# EAGLE design TB6560_stp (EAGLE 4.16)
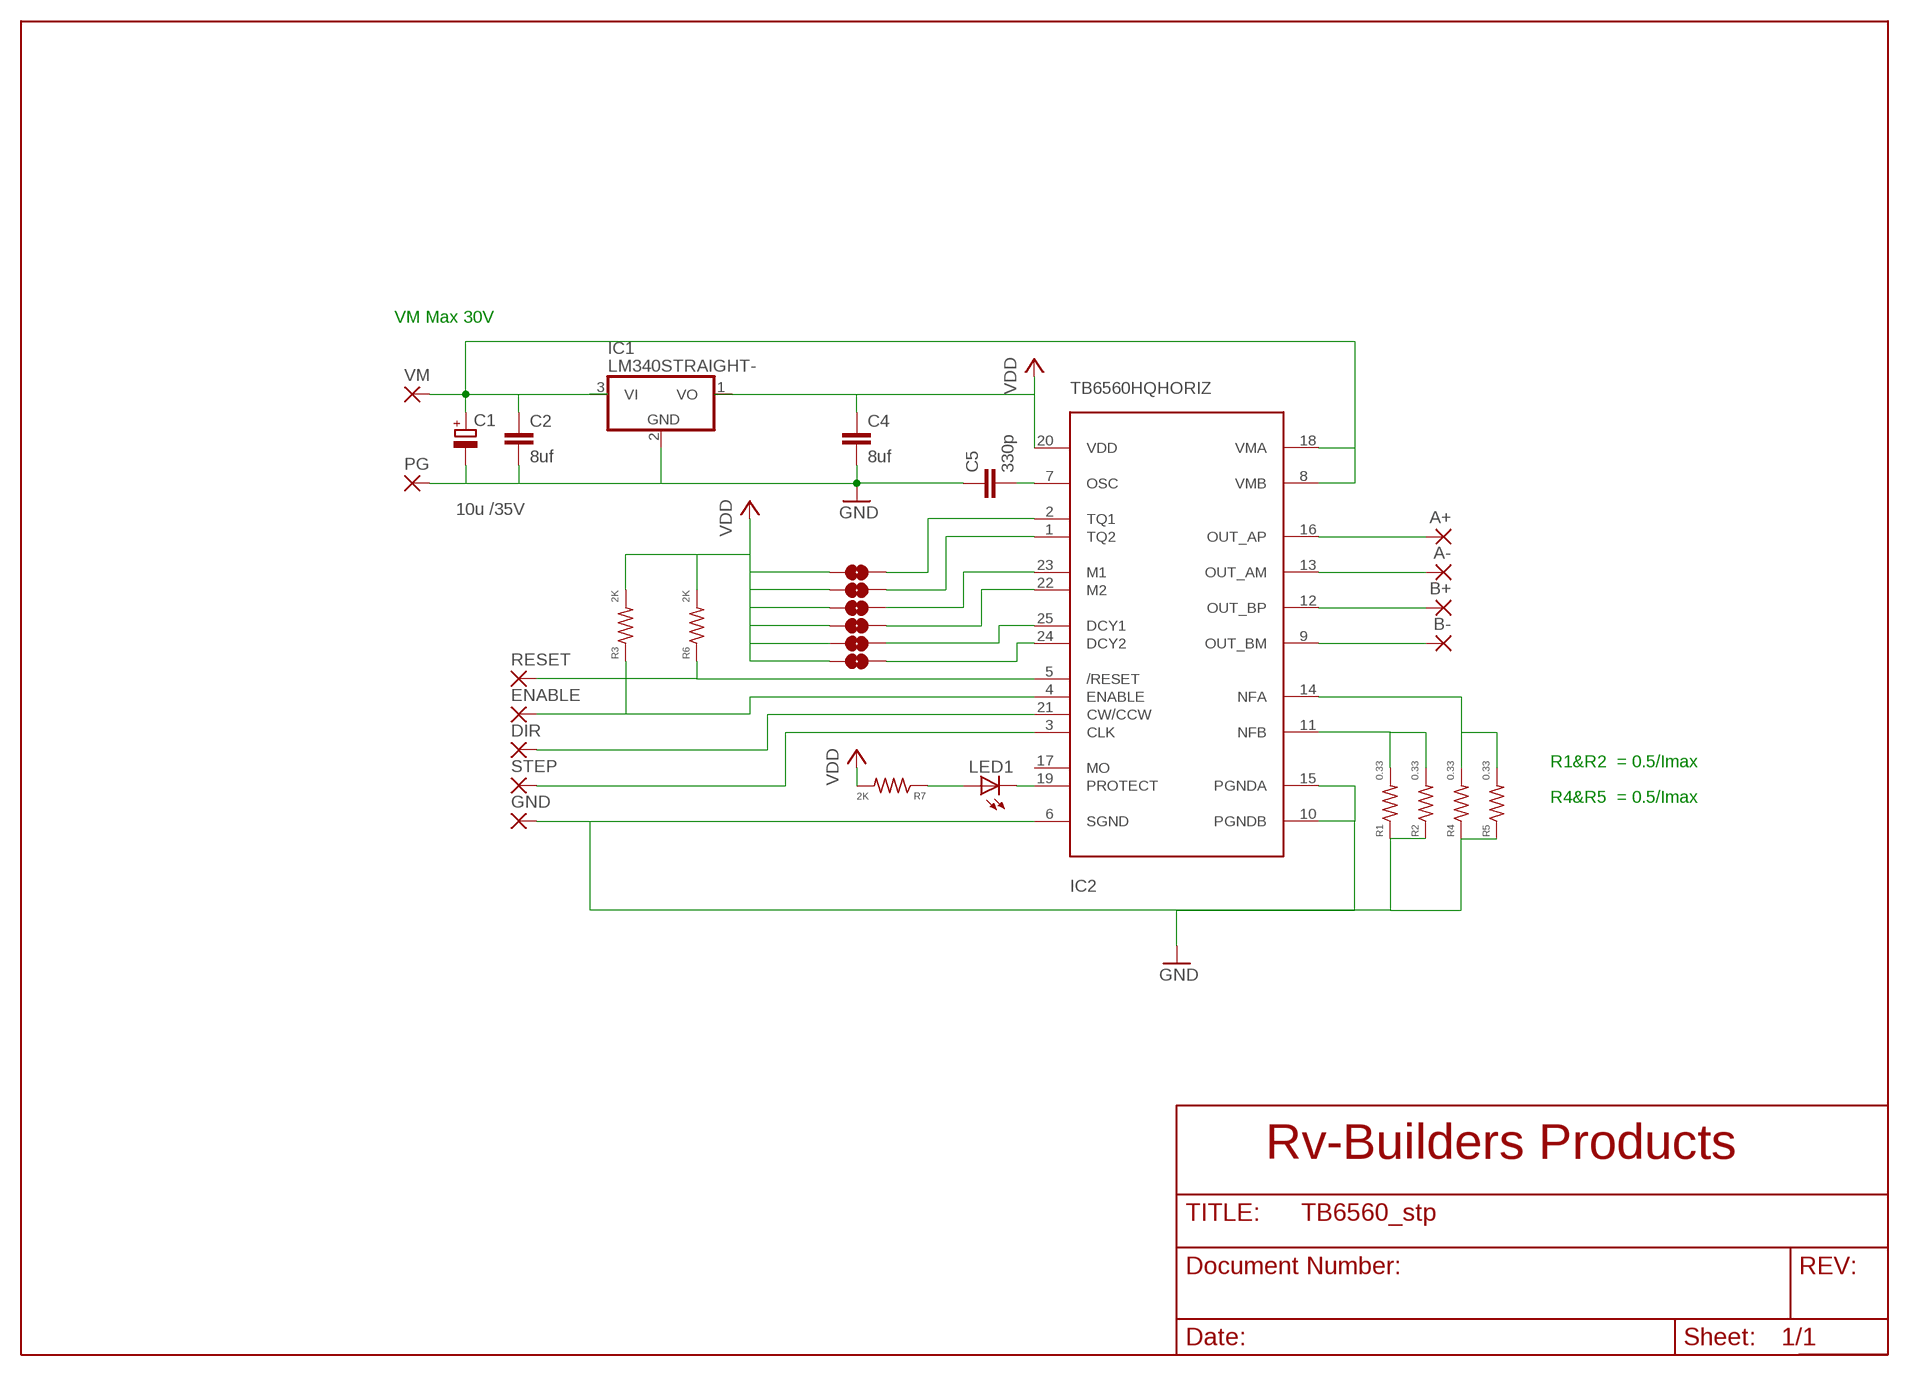
[diagram p0: schematic, sheet 1]

## Parts
A+  1,6/0,9  [1,6/0,9]
A-  1,6/0,9  [1,6/0,9]
B+  1,6/0,9  [1,6/0,9]
B-  1,6/0,9  [1,6/0,9]
C1  10u /35V  CPOL-EUSMCD  [SMC_D]
C2  8uf  C-EUC1210  [C1210]
C4  8uf  C-EUC1210  [C1210]
C5  330p  C-EUC0805  [C0805]
DIR  1,6/0,9  [1,6/0,9]
ENABLE  1,6/0,9  [1,6/0,9]
GND  1,6/0,9  [1,6/0,9]
IC1  LM340STRAIGHT-  [TO92-]
IC2  TB6560HQHORIZ  [HZIP-25]
LED1  LEDCHIP-LED0603  [CHIP-LED0603]
PG  1,6/0,9  [1,6/0,9]
R1  0.33  R-US_R2010  [R2010]
R2  0.33  R-US_R2010  [R2010]
R3  2K  R-US_R0603  [R0603]
R4  0.33  R-US_R2010  [R2010]
R5  0.33  R-US_R2010  [R2010]
R6  2K  R-US_R0603  [R0603]
R7  2K  R-US_R0603  [R0603]
RESET  1,6/0,9  [1,6/0,9]
STEP  1,6/0,9  [1,6/0,9]
U$3  SOLDERBRIDGE  [SOLDER_BRIDGE]
U$5  SOLDERBRIDGE  [SOLDER_BRIDGE]
U$6  SOLDERBRIDGE  [SOLDER_BRIDGE]
U$7  SOLDERBRIDGE  [SOLDER_BRIDGE]
U$8  SOLDERBRIDGE  [SOLDER_BRIDGE]
U$9  SOLDERBRIDGE  [SOLDER_BRIDGE]
VM  1,6/0,9  [1,6/0,9]

## Nets
+5V: C4.1 IC1.1(VO) IC2.20(VDD) R3.2 R6.2 R7.2 U$3.P$1 U$5.P$1 U$6.P$1 U$7.P$1 U$8.P$1 U$9.P$1 ; supply symbol labelled VDD
/A: A-.1(P) IC2.13(OUT_AM)
/B: B-.1(P) IC2.9(OUT_BM)
A: A+.1(P) IC2.16(OUT_AP)
B: B+.1(P) IC2.12(OUT_BP)
DCY1: IC2.25(DCY1) U$8.P$2
DCY2: IC2.24(DCY2) U$9.P$2
DIR: DIR.1(P) IC2.21(CW/CCW)
ENA: ENABLE.1(P) IC2.4(ENABLE) R3.1
GND: C1.- C2.2 C4.2 C5.1 GND.1(P) IC1.2(GND) IC2.6(SGND) IC2.10(PGNDB) IC2.15(PGNDA) PG.1(P) R1.1 R2.1 R4.1 R5.1
M1: IC2.23(M1) U$6.P$2
M2: IC2.22(M2) U$7.P$2
N$1: LED1.A R7.1
N$2: IC2.19(PROTECT) LED1.C
N$4: IC2.5(/RESET) R6.1 RESET.1(P)
NFA: IC2.14(NFA) R4.2 R5.2
NFB: IC2.11(NFB) R1.2 R2.2
OSC: C5.2 IC2.7(OSC)
STEP: IC2.3(CLK) STEP.1(P)
TQ1: IC2.2(TQ1) U$5.P$2
TQ2: IC2.1(TQ2) U$3.P$2
VM: C1.+ C2.1 IC1.3(VI) IC2.8(VMB) IC2.18(VMA) VM.1(P)
Unconnected: IC2.17(MO)

## Notes on the sheet
- VM Max 30V
- R1&R2  = 0.5/Imax
- R4&R5  = 0.5/Imax

## Library data of the parts
A+ A- B+ B- DIR ENABLE GND PG RESET STEP VM = wirepad:1,6/0,9: THROUGH-HOLE PAD
C1 = rcl:CPOL-EU: POLARIZED CAPACITOR, European symbol
C2 C4 C5 = rcl:C-EU: CAPACITOR, European symbol
IC1 = Stofer:LM340?-*: Positive VOLTAGE REGULATOR Source: http://cache.national.com/ds/LM/LM340.pdf
IC2 = Stofer:TB6560HQ
LED1 = led:LED: LED OSRAM: - CHIPLED LG R971, LG N971, LY N971, LG Q971, LY Q971, LO R971, LY R971 LH N974, LH R974 LS Q976, LO Q976, LY Q976 LO Q996 - Hyper CHIPLED LW Q18S LB Q993, LB Q99A, LB R99A - SideLED LS A670, LO A670, LY A670, LG A670, LP A670 LB A673, LV A673, LT A673, LW A673 LH A674 LY A675 LS A676, LA A676, LO A676, LY A676, LW A676 LS A679, LY A679, LG A679 - Hyper Micro SIDELED® LS Y876, LA Y876, LO Y876, LY Y876 LT Y87S - SmartLED LW L88C, LW L88S LB L89C, LB L89S, LG L890 LS L89K, LO L89K, LY L89K LS L896, LA L896, LO L896, LY L896 - TOPLED LS T670, LO T670, LY T670, LG T670, LP T670 LSG T670, LSP T670, LSY T670, LOP T670, LYG T670 LG T671, LOG T671, LSG T671 LB T673, LV T673, LT T673, LW T673 LH T674 LS T676, LA T676, LO T676, LY T676, LB T676, LH T676, LSB T676, LW T676 LB T67C, LV T67C, LT T67C, LS T67K, LO T67K, LY T67K, LW E67C LS E67B, LA E67B, LO E67B, LY E67B, LB E67C, LV E67C, LT E67C LW T67C LS T679, LY T679, LG T679 LS T770, LO T770, LY T770, LG T770, LP T770 LB T773, LV T773, LT T773, LW T773 LH T774 LS E675, LA E675, LY E675, LS T675 LS T776, LA T776, LO T776, LY T776, LB T776 LHGB T686 LT T68C, LB T68C - Hyper Mini TOPLED® LB M676 - Mini TOPLED Santana® LG M470 LS M47K, LO M47K, LY M47K Source: http://www.osram.convergy.de - LUMILED® LXK2-PW12-R00, LXK2-PW12-S00, LXK2-PW14-U00, LXK2-PW14-V00 LXK2-PM12-R00, LXK2-PM12-S00, LXK2-PM14-U00 LXK2-PE12-Q00, LXK2-PE12-R00, LXK2-PE12-S00, LXK2-PE14-T00, LXK2-PE14-U00 LXK2-PB12-K00, LXK2-PB12-L00, LXK2-PB12-M00, LXK2-PB14-N00, LXK2-PB14-P00, LXK2-PB14-Q00 LXK2-PR12-L00, LXK2-PR12-M00, LXK2-PR14-Q00, LXK2-PR14-R00 LXK2-PD12-Q00, LXK2-PD12-R00, LXK2-PD12-S00 LXK2-PH12-R00, LXK2-PH12-S00 LXK2-PL12-P00, LXK2-PL12-Q00, LXK2-PL12-R00 Source: www.luxeon.com
R1-R7 = rcl:R-US_: RESISTOR, American symbol
U$3 U$5-U$9 = Stofer:SOLDERBRIDGE

## Board
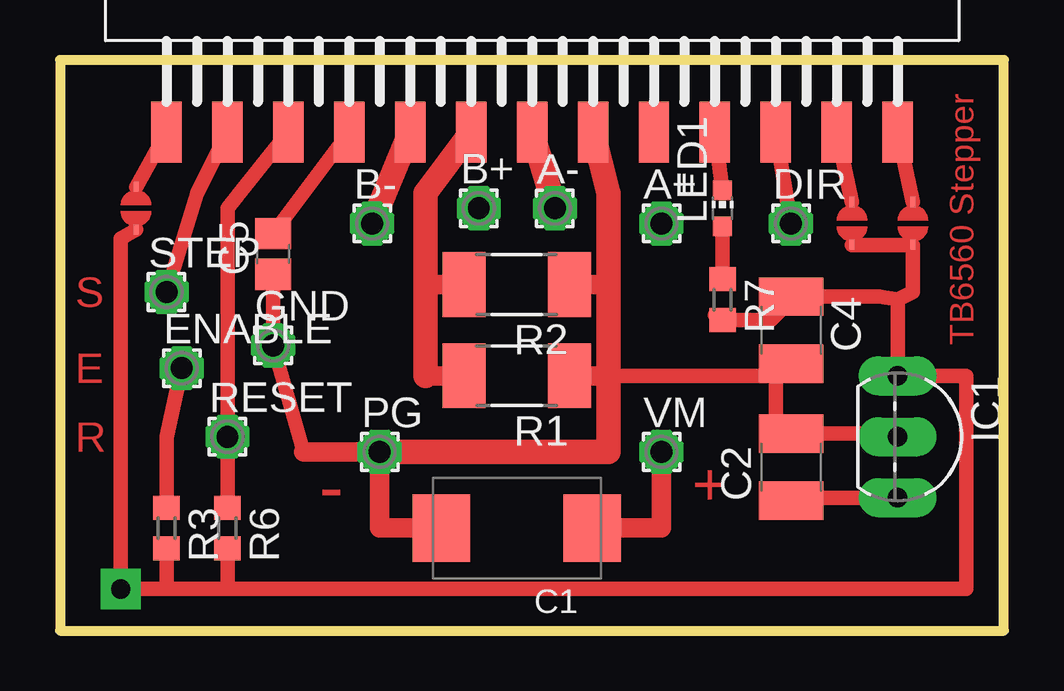
[diagram p1: board, top side]
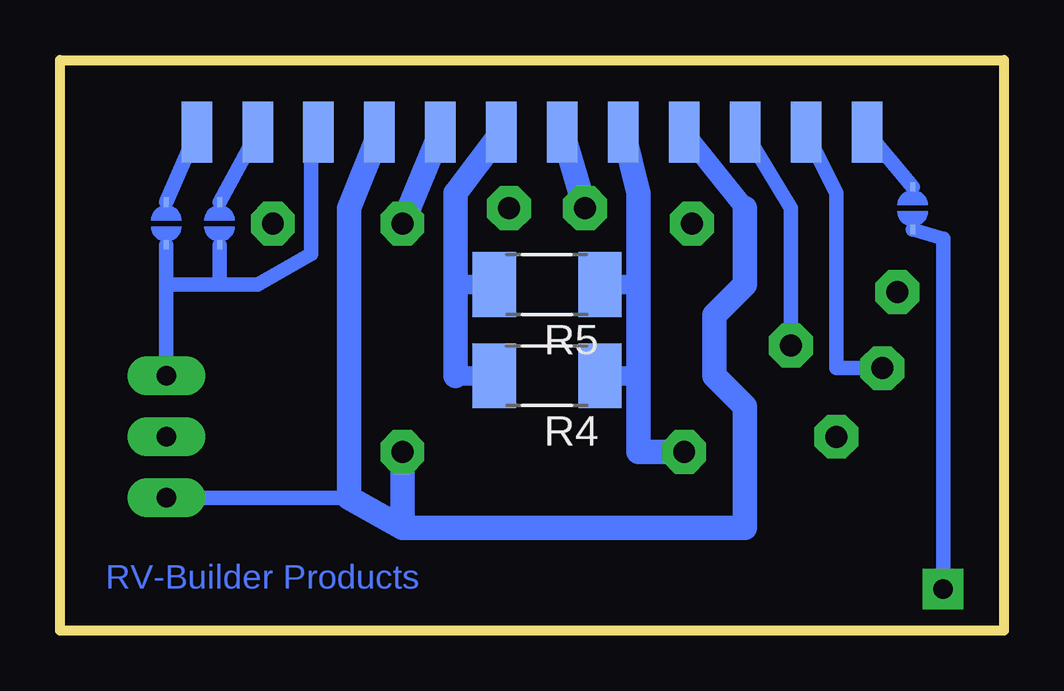
[diagram p2: board, bottom side, seen from below]

Size 39.35 x 23.8 mm. Coordinates in mm from the lower left corner, seen from the top.
Outline: 0,0 39.35,0 39.35,23.8 0,23.8 0,0
Copper layers (1*2+15*16): Top 0.035mm / dielectric 0.2mm / Route2 0.035mm / dielectric 0.15mm / Route15 0.035mm / dielectric 0.2mm / Bottom 0.035mm
Design rules "default": minimum track width 10mil, minimum drill 24mil, track to track 8mil, track to pad 8mil, pad to pad 8mil, via to via 8mil, smd to smd 8mil, copper to edge 40mil, drill to drill 8mil, minimum pad ring 10mil, minimum via ring 8mil, stop-mask expansion 4mil, vias tented up to drill 0mil, thermal gap 10mil

### Footprints (pad centres in the part's own frame; a part is rotated, then mirrored left to right if it is on the bottom)
1,6/0,9 = drill 0.914 pad 1.6 octagon: 1 0,0
SMC_D = smd 2.4 x 2.8: + -3.15,0; - 3.15,0
C1210 = smd 1.6 x 2.7: 1 -1.4,0; 2 1.4,0
C0805 = smd 1.3 x 1.5: 1 -0.85,0; 2 0.85,0
TO92- = drill 0.813 long: 1 -2.54,-1.27; 2 0,-1.27; 3 2.54,-1.27
HZIP-25 = smd 1.27 x 2.54: 1 -15.24,-6.35; 3 -12.7,-6.35; 5 -10.16,-6.35; 7 -7.62,-6.35; 9 -5.08,-6.35; 11 -2.54,-6.35; 13 0,-6.35; 15 2.54,-6.35; 17 5.08,-6.35; 19 7.62,-6.35; 21 10.16,-6.35; 23 12.7,-6.35; 25 15.24,-6.35 | smd 1.27 x 2.54 bottom: 2 -13.97,-6.35; 4 -11.43,-6.35; 6 -8.89,-6.35; 8 -6.35,-6.35; 10 -3.81,-6.35; 12 -1.27,-6.35; 14 1.27,-6.35; 16 3.81,-6.35; 18 6.35,-6.35; 20 8.89,-6.35; 22 11.43,-6.35; 24 13.97,-6.35
CHIP-LED0603 = smd 0.8 x 0.8: A 0,-0.75; C 0,0.75
R2010 = smd 1.8 x 2.7: 1 -2.2,0; 2 2.2,0
R0603 = smd 1 x 1.1: 1 -0.85,0; 2 0.85,0
SOLDER_BRIDGE = smd 0.406 x 0.203: P$1 -0.889,0.635; P$2 0.889,0.635

### Placement (x,y rotation side)
A+  25.08,16.98 0 top
A-  20.63,17.61 0 top
B+  17.46,17.61 0 top
B-  13.01,16.98 0 top
C1  19.04,4.28 180 top
C2  30.47,6.82 90 top
C4  30.47,12.54 270 top
C5  8.88,15.71 90 top
DIR  30.47,16.98 0 top
ENABLE  5.07,10.95 0 top
GND  8.88,11.9 0 top
IC1  36.19,8.09 270 top
IC2  19.68,27.14 0 top
LED1  27.62,17.61 0 top
PG  13.33,7.46 0 top
R1  19.04,10.63 180 top
R2  19.04,14.44 180 top
R3  4.44,4.28 270 top
R4  19.04,10.63 180 bottom
R5  19.04,14.44 180 bottom
R6  6.98,4.28 270 top
R7  27.62,13.81 270 top
RESET  6.98,8.09 0 top
STEP  4.44,14.12 0 top
U$3  3.8,17.61 90 top
U$5  3.17,17.61 90 bottom
U$6  33.65,16.98 90 top
U$7  32.06,16.98 90 bottom
U$8  36.19,16.98 90 top
U$9  34.28,16.98 90 bottom
VM  25.08,7.46 0 top

### Tracks (layer width: path | path; a pad name or v marks a point on that pad's centre or on a via)
+5V  (via drill 0.8 pad 1.68)
  Top 0.406: 6.98,3.01 R6.2 | 30.47,13.81 30.26,13.59
  Top 0.61: U$3.P$1 2.54,16.34 v2.54,1.74 4.44,1.74 | U$6.P$1 U$8.P$1 35.55,14.12 34.92,13.81 | 34.92,13.81 IC1.1 37.78,10.63 37.78,1.74 6.98,1.74 | 34.92,13.81 34.16,13.94 C4.1 30.47,13.81 29.62,12.96 R7.2 27.4,13.17 27.3,13.17 | 4.44,1.74 6.98,1.74 | 6.98,1.74 6.98,3.01 | 4.44,1.74 R3.2
  Bottom 0.406: 28.89,20.79 IC2.20 | 31.11,14.44 32.7,14.44
  Bottom 0.61: 28.89,20.79 28.89,15.71 31.11,14.44 34.92,14.44 | 32.7,14.44 U$7.P$1 | 34.92,14.44 U$9.P$1 | IC1.1 34.92,14.44 | U$5.P$1 2.54,16.34 v2.54,1.74
/A
  Top 1.016: A-.1 IC2.13
/B
  Top 1.016: B-.1 IC2.9
A
  Bottom 1.016: A+.1 IC2.16
B
  Bottom 1.016: B+.1 IC2.12
DCY1
  Top 0.61: U$8.P$2 IC2.25
DCY2
  Bottom 0.61: U$9.P$2 IC2.24
DIR
  Top 0.61: DIR.1 IC2.21
ENA
  Top 0.61: ENABLE.1 4.44,8.09 R3.1
  Bottom 0.61: IC2.4 6.98,18.25 6.98,10.95 ENABLE.1
GND
  Top 0.406: R1.1 20.95,10.63 | 29.84,10.63 31.11,10.63 | C2.2 30.47,8.09 29.84,8.09
  Top 0.61: C5.1 GND.1 10.16,7.46 | R1.1 22.85,10.63 29.84,10.63 | R2.1 20.95,14.44 | 29.84,10.63 29.84,8.09 | C4.2 30.34,11.13 29.84,10.63 | C2.2 34.79,8.22 IC1.2
  Top 0.813: 22.85,14.44 R2.1 | 22.85,10.63 20.95,10.63 | 10.16,7.46 PG.1 13.33,4.28 C1.-
  Top 1.016: IC2.15 22.85,18.25 22.85,14.44 22.85,10.63 22.85,7.46 PG.1
  Bottom 0.61: GND.1 8.88,17.61 IC2.6
  Bottom 0.813: 15.24,10.63 R4.1 | 15.24,14.44 R5.1
  Bottom 1.016: IC2.10 15.24,18.25 15.24,14.44 15.24,10.63 15.24,7.46 PG.1
M1
  Top 0.61: U$6.P$2 IC2.23
M2
  Bottom 0.61: U$7.P$2 IC2.22
N$1
  Top 0.61: R7.1 LED1.A
N$2
  Top 0.61: LED1.C IC2.19
N$4
  Top 0.61: R6.1 RESET.1 6.98,17.61 IC2.5
NFA
  Bottom 0.406: R4.2 20.95,10.63
  Bottom 0.61: R5.2 20.95,14.44
  Bottom 0.813: 22.85,14.44 R5.2 | R4.2 22.85,10.63
  Bottom 1.016: IC2.14 22.85,18.25 22.85,14.44 22.85,10.63
NFB
  Top 0.813: 15.24,14.44 R2.2 | R1.2 15.24,10.63
  Top 1.016: 15.24,10.63 15.24,14.44 15.24,18.25 IC2.11
OSC
  Top 0.61: C5.2 IC2.7
STEP
  Top 0.61: STEP.1 5.71,18.25 IC2.3
TQ1
  Bottom 0.61: U$5.P$2 IC2.2
TQ2
  Top 0.61: U$3.P$2 IC2.1
VM
  Top 0.406: 30.47,5.55 C2.1
  Top 0.61: IC1.3 30.47,5.55
  Top 0.813: C1.+ 25.08,4.28 VM.1
  Bottom 0.61: 27.3,5.55 IC1.3
  Bottom 0.813: 10.79,17.61 IC2.8
  Bottom 1.016: IC2.18 27.3,17.61 27.3,5.55 25.08,4.28 | 25.08,4.28 10.79,4.28 10.79,9.36 12.06,10.63 12.06,13.17 10.79,14.44 10.79,17.61 | 25.08,4.28 VM.1

### Text on the board
Top: S | TB6560 Stepper | E | R | + | -
Bottom: RV-Builder Products